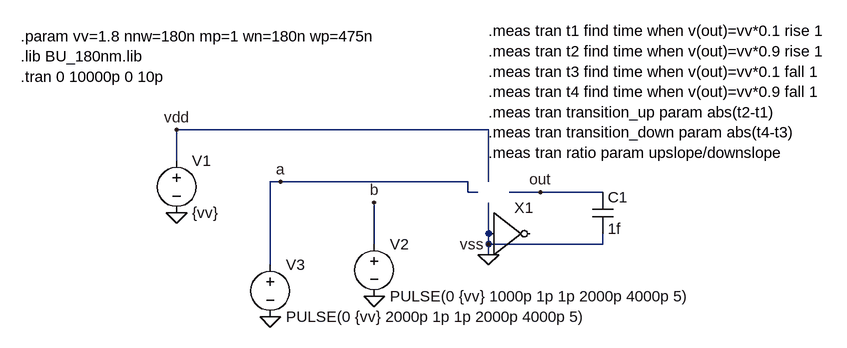
[diagram p0: schematic inv_test.asc]
inv_test.asc, the LTspice schematic file:
Version 4
SHEET 1 1168 680
WIRE 416 224 -64 224
WIRE -64 272 -64 224
WIRE 96 304 80 304
WIRE 384 304 96 304
WIRE 416 304 416 224
WIRE 384 320 384 304
WIRE 400 320 384 320
WIRE 496 320 448 320
WIRE 592 320 496 320
WIRE 240 400 240 336
WIRE 416 400 416 336
WIRE 592 400 592 384
WIRE 592 400 416 400
WIRE 416 416 416 400
WIRE 80 432 80 304
FLAG -64 352 0
FLAG 240 480 0
FLAG 416 416 0
FLAG -64 224 vdd
FLAG 416 400 vss
FLAG 240 336 b
FLAG 496 320 out
FLAG 80 512 0
FLAG 96 304 a
SYMBOL /voltage -64 256 R0
SYMATTR InstName V1
SYMATTR Value {vv}
SYMBOL /voltage 240 384 R0
SYMATTR InstName V2
SYMATTR Value PULSE(0 {vv} 1000p 1p 1p 2000p 4000p 5)
SYMBOL /voltage 80 416 R0
SYMATTR InstName V3
SYMATTR Value PULSE(0 {vv} 2000p 1p 1p 2000p 4000p 5)
SYMBOL cap 576 320 R0
SYMATTR InstName C1
SYMATTR Value 1f
SYMBOL inv 416 320 R0
SYMATTR InstName X1
TEXT -304 80 Left 2 !.param vv=1.8 nnw=180n mp=1 wn=180n wp=475n\n.lib BU_180nm.lib\n.tran 0 10000p 0 10p
TEXT 416 72 Left 2 !.meas tran t1 find time when v(out)=vv*0.1 rise 1\n.meas tran t2 find time when v(out)=vv*0.9 rise 1\n.meas tran t3 find time when v(out)=vv*0.1 fall 1\n.meas tran t4 find time when v(out)=vv*0.9 fall 1\n.meas tran transition_up param abs(t2-t1)\n.meas tran transition_down param abs(t4-t3)\n.meas tran ratio param upslope/downslope

The netlist it stands for:
* inv_test.asc
V1 vdd 0 {vv}
V2 b 0 PULSE(0 {vv} 1000p 1p 1p 2000p 4000p 5)
V3 a 0 PULSE(0 {vv} 2000p 1p 1p 2000p 4000p 5)
C1 out 0 1f
A§X1 0 0 0 0 0 0 0 0 BUF
.param vv=1.8 nnw=180n mp=1 wn=180n wp=475n
.lib BU_180nm.lib
.tran 0 10000p 0 10p
.meas tran t1 find time when v(out)=vv*0.1 rise 1
.meas tran t2 find time when v(out)=vv*0.9 rise 1
.meas tran t3 find time when v(out)=vv*0.1 fall 1
.meas tran t4 find time when v(out)=vv*0.9 fall 1
.meas tran transition_up param abs(t2-t1)
.meas tran transition_down param abs(t4-t3)
.meas tran ratio param upslope/downslope
.backanno
.end

* Results of the author's LTspice run, read from the files saved beside the schematic
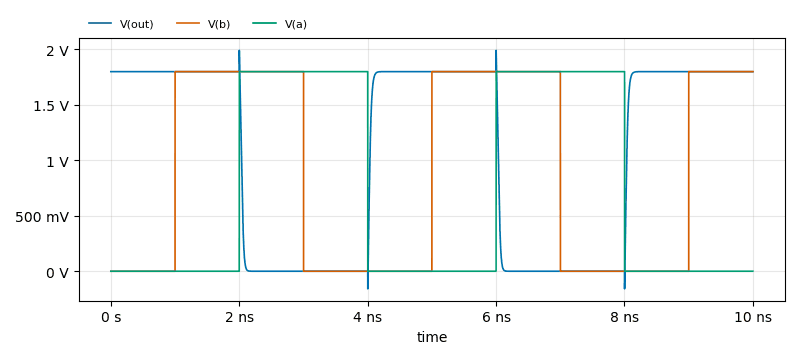
[diagram p1: Transient Analysis of inv_test.asc, plotted from the saved traces]
* Transient Analysis, 1 run:
*   V(out): min -158.5 mV, max 1.992 V, average 1.082 V, rms 1.389 V, last 1.8 V
*   V(b): min 0 V, max 1.8 V, average 900.3 mV, rms 1.273 V, last 1.8 V
*   V(a): min 0 V, max 1.8 V, average 720.4 mV, rms 1.139 V, last 0 V
* From the log:
*   t1: time=4.01061e-009 at 4.01061e-009
*   t2: time=4.07138e-009 at 4.07138e-009
*   t3: time=2.07475e-009 at 2.07475e-009
*   t4: time=2.014e-009 at 2.014e-009
*   transition_up: abs(t2-t1)=6.07742e-011
*   transition_down: abs(t4-t3)=6.07464e-011
*   Measurement "ratio" FAIL'ed